# EAGLE design main (EAGLE 7.2.0)
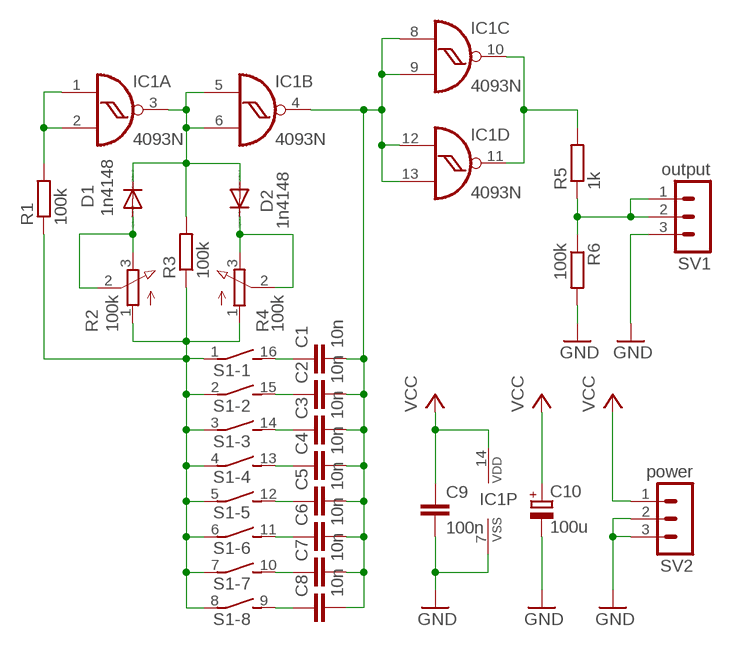
[diagram p0: schematic, sheet 1]

## Parts
C1  10n  C-EU050-025X075  [C050-025X075]
C2  10n  C-EU050-025X075  [C050-025X075]
C3  10n  C-EU050-025X075  [C050-025X075]
C4  10n  C-EU050-025X075  [C050-025X075]
C5  10n  C-EU050-025X075  [C050-025X075]
C6  10n  C-EU050-025X075  [C050-025X075]
C7  10n  C-EU050-025X075  [C050-025X075]
C8  10n  C-EU050-025X075  [C050-025X075]
C9  100n  C-EUC1206  [C1206]
C10  100u  CPOL-EUE2.5-7  [E2,5-7]
D1  1n4148  DIODE-MINIMELF  [MINIMELF]
D2  1n4148  DIODE-MINIMELF  [MINIMELF]
IC1  4093N  [DIL14]
R1  100k  R-EU_0204/2V  [0204V]
R2  100k  3RP/1610N  [3RP/1610N]
R3  100k  R-EU_0204/2V  [0204V]
R4  100k  3RP/1610N  [3RP/1610N]
R5  1k  R-EU_0204/2V  [0204V]
R6  100k  R-EU_0204/2V  [0204V]
S1  DIP08S  [DIP08S]
SV1  output  MA03-1  [MA03-1]
SV2  power  MA03-1  [MA03-1]

## Nets
GND: C9.2 C10.- IC1.7(P:VSS) R6.2 SV1.3 SV2.2 SV2.3
N$1: D1.C D2.A IC1.3(A:O) IC1.5(B:I0) IC1.6(B:I1) R3.2
N$2: IC1.1(A:I0) IC1.2(A:I1) R1.2
N$3: D1.A R2.2(S) R2.3(E)
N$4: C1.1 S1.16
N$5: IC1.10(C:O) IC1.11(D:O) R5.2
N$6: R5.1 R6.1 SV1.1 SV1.2
N$7: C2.1 S1.15
N$9: C3.1 S1.14
N$10: C4.1 S1.13
N$11: C5.1 S1.12
N$12: C6.1 S1.11
N$13: C7.1 S1.10
N$14: C8.1 S1.9
N$16: C1.2 C2.2 C3.2 C4.2 C5.2 C6.2 C7.2 C8.2 IC1.4(B:O) IC1.8(C:I0) IC1.9(C:I1) IC1.12(D:I0) IC1.13(D:I1)
N$17: D2.C R4.2(S) R4.3(E)
N$18: R1.1 R2.1(A) R3.1 R4.1(A) S1.1 S1.2 S1.3 S1.4 S1.5 S1.6 S1.7 S1.8
VCC: C9.1 C10.+ IC1.14(P:VDD) SV2.1

## Library data of the parts
C1-C9 = resistor:C-EU: CAPACITOR, European symbol
C10 = resistor:CPOL-EU: POLARIZED CAPACITOR, European symbol
D1 D2 = diode:DIODE-: DIODE
IC1 = 40xx:4093: Quad 2-input NAND schmitt trigger
R1 R3 R5 R6 = resistor:R-EU_: RESISTOR, European symbol
R2 R4 = pot:3RP/1610N: 16mm Potentiometer one level Source: http://www.alphapotentiometers.net/html/16mm_pot_2.html
S1 = switch-dil:DIP08S: DIL/CODE SWITCH; OC_FARNELL: unknown; OC_NEWARK: unknown
SV1 SV2 = con-lstb:MA03-1: PIN HEADER; OC_FARNELL: unknown; OC_NEWARK: unknown

## Net classes
0 default: width 0.406 mm

## Board
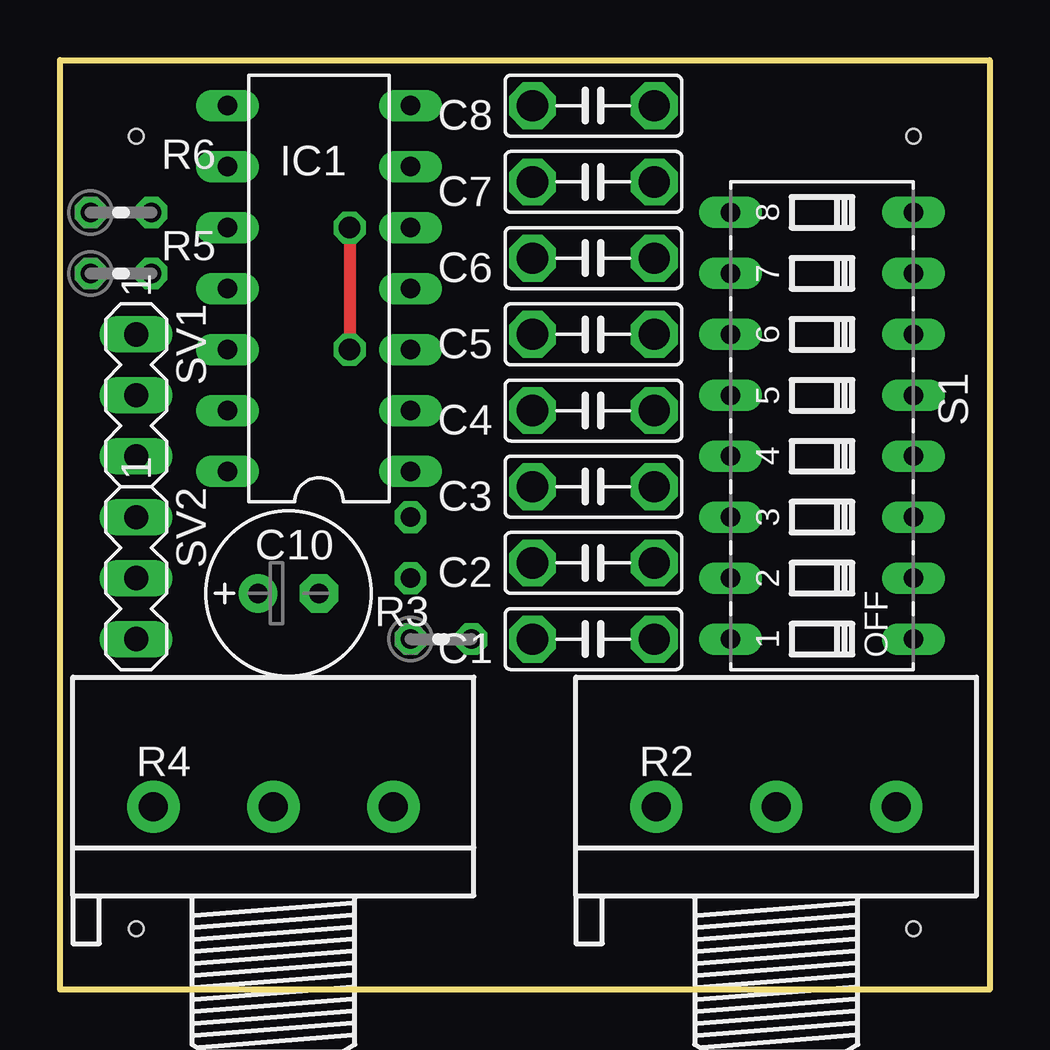
[diagram p1: board, top side]
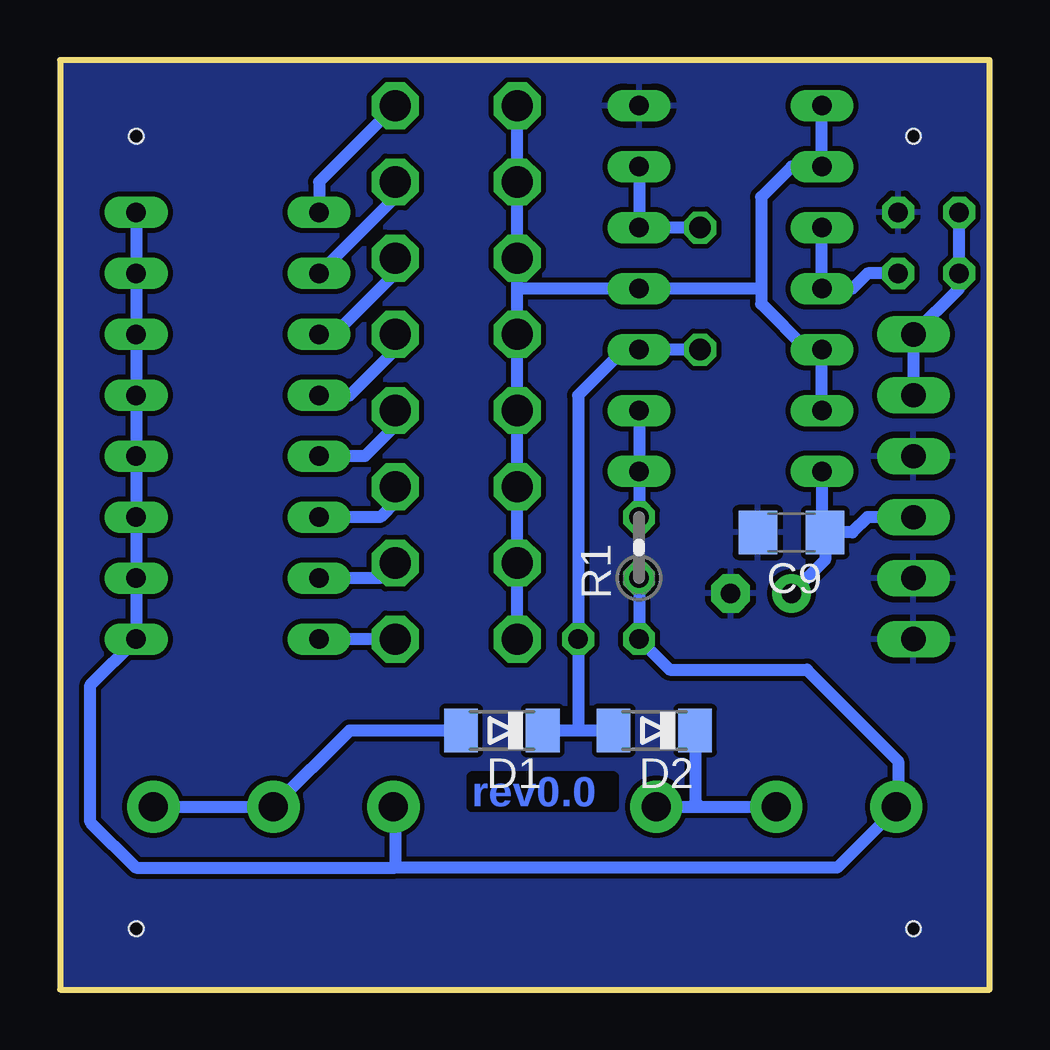
[diagram p2: board, bottom side, seen from below]

Size 38.73 x 38.73 mm. Coordinates in mm from the lower left corner, seen from the top.
Outline: 0,38.73 38.73,38.73 38.73,0 0,0 0,38.73
Copper layers (1*16): Top 0.035mm / dielectric 1.5mm / Bottom 0.035mm
Design rules "default *": minimum track width 10mil, minimum drill 24mil, track to track 8mil, track to pad 8mil, pad to pad 8mil, via to via 8mil, smd to smd 8mil, copper to edge 0mil, drill to drill 8mil, minimum pad ring 10mil, minimum via ring 8mil, stop-mask expansion 4mil, vias tented up to drill 0mil, thermal gap 10mil
Holes 0.6 mm at 3.17,2.54 35.56,2.54 35.56,35.56 3.17,35.56

### Footprints (pad centres in the part's own frame; a part is rotated, then mirrored left to right if it is on the bottom)
C050-025X075 = drill 1.3 octagon: 1 -2.54,0; 2 2.54,0
C1206 = smd 1.6 x 1.8: 1 -1.4,0; 2 1.4,0
E2,5-7 = drill 0.813 pad 1.6: + -1.27,0 | drill 0.813 pad 1.6 octagon: - 1.27,0
MINIMELF = smd 1.4 x 1.8: A 1.7,0; C -1.7,0
DIL14 = drill 0.813 long: 1 -7.62,-3.81; 2 -5.08,-3.81; 3 -2.54,-3.81; 4 0,-3.81; 5 2.54,-3.81; 6 5.08,-3.81; 7 7.62,-3.81; 8 7.62,3.81; 9 5.08,3.81; 10 2.54,3.81; 11 0,3.81; 12 -2.54,3.81; 13 -5.08,3.81; 14 -7.62,3.81
0204V = drill 0.813 octagon: 1 -1.27,0; 2 1.27,0
3RP/1610N = drill 1.2 pad 2.184: 1 -5,0; 2 0,0; 3 5,0
DIP08S = drill 0.813 long: 1 -8.89,-3.81; 2 -6.35,-3.81; 3 -3.81,-3.81; 4 -1.27,-3.81; 5 1.27,-3.81; 6 3.81,-3.81; 7 6.35,-3.81; 8 8.89,-3.81; 9 8.89,3.81; 10 6.35,3.81; 11 3.81,3.81; 12 1.27,3.81; 13 -1.27,3.81; 14 -3.81,3.81; 15 -6.35,3.81; 16 -8.89,3.81
MA03-1 = drill 1.016 long: 1 -2.54,0; 2 0,0; 3 2.54,0

### Placement (x,y rotation side)
C1  22.23,14.6 180 top
C2  22.23,17.78 180 top
C3  22.23,20.95 180 top
C4  22.23,24.13 180 top
C5  22.23,27.3 180 top
C6  22.23,30.48 180 top
C7  22.23,33.66 180 top
C8  22.23,36.83 180 top
C9  8.26,19.05 180 bottom
C10  9.52,16.51 0 top
D1  20.32,10.79 180 bottom
D2  13.97,10.79 180 bottom
IC1  10.8,29.21 90 top
R1  14.6,18.41 90 bottom
R2  29.84,7.62 0 top
R3  15.88,14.6 0 top
R4  8.89,7.62 0 top
R5  2.54,29.84 0 top
R6  2.54,32.38 0 top
S1  31.75,23.49 90 top
SV1  3.17,24.77 270 top
SV2  3.17,17.15 270 top

### Tracks (layer width: path | path; a pad name or v marks a point on that pad's centre or on a via)
GND
  pour Bottom: 0,38.73 0,0 38.73,0 38.73,38.73
N$1  (via drill 0.89)
  Top 0.508: v12.06,31.75 v12.06,26.67
  Bottom 0.508: IC1.6 IC1.5 v12.06,31.75 | D2.A 17.14,10.79 | 17.14,10.79 D1.C | v12.06,26.67 IC1.3 15.24,26.67 17.14,24.77 R3.2 17.14,10.79
N$2
  Bottom 0.508: R1.2 IC1.1 IC1.2
N$3
  Bottom 0.508: 34.93,7.7 R2.3 R2.2 26.67,10.79 D1.A
N$4
  Bottom 0.508: C1.1 S1.16
N$5
  Bottom 0.508: IC1.10 IC1.11 5.71,29.21 5.08,29.84 R5.2
N$6
  Bottom 0.508: SV1.2 SV1.1 1.27,29.21 R5.1 R6.1
N$7
  Bottom 0.508: C2.1 25.4,17.15 S1.15
N$9
  Bottom 0.508: C3.1 24.77,20.32 25.4,19.69 S1.14
N$10
  Bottom 0.508: C4.1 24.77,23.49 26.03,22.23 S1.13
N$11
  Bottom 0.508: C5.1 24.77,26.67 26.67,24.77 S1.12
N$12
  Bottom 0.508: C6.1 24.77,29.84 27.3,27.3 S1.11
N$13
  Bottom 0.508: C7.1 24.77,33.02 S1.10
N$14
  Bottom 0.508: C8.1 27.94,33.66 S1.9
N$16
  Bottom 0.508: C1.2 C2.2 C3.2 C4.2 C5.2 19.69,29.21 | 19.69,29.21 C6.2 C7.2 C8.2 | IC1.8 IC1.9 8.26,34.29 9.52,33.02 9.52,29.21 | 9.52,29.21 IC1.4 19.69,29.21 | IC1.13 IC1.12 7.62,26.67 9.52,28.57 9.52,29.21
N$17
  Bottom 0.508: R4.3 12.06,7.62 | 12.06,7.62 R4.2 | D2.C 12.27,7.83 12.06,7.62
N$18
  Bottom 0.508: S1.8 S1.7 S1.6 S1.5 S1.4 S1.3 S1.2 S1.1 37.46,12.7 37.46,6.99 35.56,5.08 24.77,5.08 | 24.77,5.08 6.35,5.08 3.89,7.54 R4.1 3.81,7.7 3.81,9.53 7.62,13.33 13.34,13.33 R3.1 R1.1 | R2.1 24.77,7.62 24.77,5.08
VCC
  Bottom 0.508: IC1.14 6.98,19.18 C9.1 | C9.1 6.85,17.91 C10.+ | SV2.1 5.08,19.69 5.71,19.05 C9.1

### Text on the board
Bottom: rev0.0